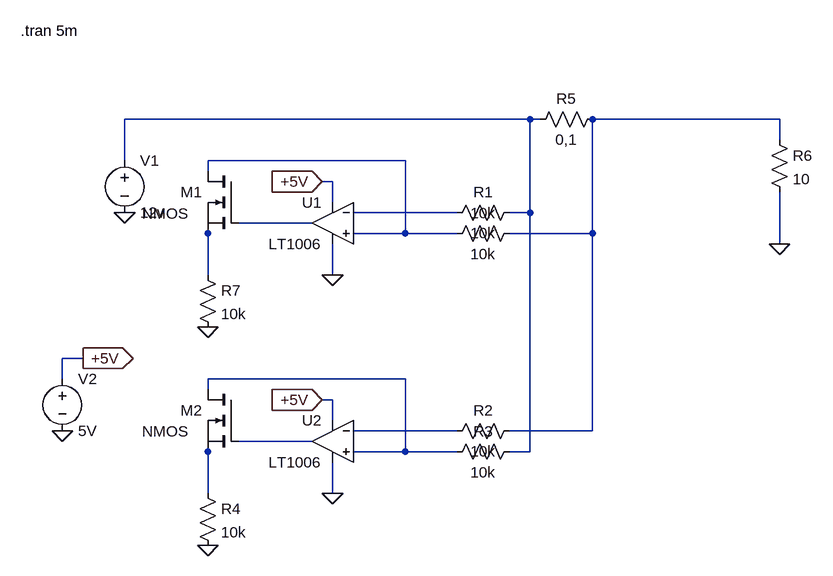
[diagram p0: schematic Meusure courrant bidir 1.asc]
Meusure courrant bidir 1.asc, the LTspice schematic file:
Version 4
SHEET 1 1092 884
WIRE 656 176 32 176
WIRE 672 176 656 176
WIRE 1040 176 752 176
WIRE 1040 208 1040 176
WIRE 32 240 32 176
WIRE 464 240 160 240
WIRE 160 256 160 240
WIRE 352 272 336 272
WIRE 352 304 352 272
WIRE 544 320 384 320
WIRE 656 320 656 176
WIRE 656 320 624 320
WIRE 320 336 208 336
WIRE 160 352 160 336
WIRE 464 352 464 240
WIRE 464 352 384 352
WIRE 544 352 464 352
WIRE 752 352 752 176
WIRE 752 352 624 352
WIRE 1040 368 1040 288
WIRE 160 416 160 352
WIRE 352 416 352 368
WIRE -32 544 -64 544
WIRE -64 576 -64 544
WIRE 464 576 160 576
WIRE 160 592 160 576
WIRE 352 608 336 608
WIRE 352 640 352 608
WIRE 544 656 384 656
WIRE 752 656 752 352
WIRE 752 656 624 656
WIRE 320 672 208 672
WIRE 160 688 160 672
WIRE 464 688 464 576
WIRE 464 688 384 688
WIRE 544 688 464 688
WIRE 656 688 656 320
WIRE 656 688 624 688
WIRE 160 752 160 688
WIRE 352 752 352 704
FLAG 32 320 0
FLAG 1040 368 0
FLAG -32 544 +5V
IOPIN -32 544 Out
FLAG -64 656 0
FLAG 160 496 0
FLAG 336 272 +5V
IOPIN 336 272 In
FLAG 352 416 0
FLAG 160 832 0
FLAG 336 608 +5V
IOPIN 336 608 In
FLAG 352 752 0
SYMBOL OpAmps/LT1006 352 272 M0
SYMATTR InstName U1
SYMBOL res 640 304 R90
WINDOW 0 0 56 VBottom 2
WINDOW 3 32 56 VTop 2
SYMATTR InstName R1
SYMATTR Value 10k
SYMBOL res 640 336 R90
WINDOW 0 0 56 VBottom 2
WINDOW 3 32 56 VTop 2
SYMATTR InstName 10k
SYMATTR Value 10k
SYMBOL res 768 160 R90
WINDOW 0 0 56 VBottom 2
WINDOW 3 32 56 VTop 2
SYMATTR InstName R5
SYMATTR Value 0,1
SYMBOL voltage 32 224 R0
SYMATTR InstName V1
SYMATTR Value 12v
SYMBOL res 1024 192 R0
SYMATTR InstName R6
SYMATTR Value 10
SYMBOL voltage -64 560 R0
SYMATTR InstName V2
SYMATTR Value 5V
SYMBOL nmos 208 256 M0
WINDOW 3 77 65 Left 2
SYMATTR InstName M1
SYMBOL res 144 400 R0
SYMATTR InstName R7
SYMATTR Value 10k
SYMBOL OpAmps/LT1006 352 608 M0
SYMATTR InstName U2
SYMBOL res 640 640 R90
WINDOW 0 0 56 VBottom 2
WINDOW 3 32 56 VTop 2
SYMATTR InstName R2
SYMATTR Value 10k
SYMBOL res 640 672 R90
WINDOW 0 0 56 VBottom 2
WINDOW 3 32 56 VTop 2
SYMATTR InstName R3
SYMATTR Value 10k
SYMBOL nmos 208 592 M0
WINDOW 3 77 65 Left 2
SYMATTR InstName M2
SYMBOL res 144 736 R0
SYMATTR InstName R4
SYMATTR Value 10k
TEXT -128 40 Left 2 !.tran 5m

The netlist it stands for:
* Meusure courrant bidir 1.asc
XU1 N003 N004 +5V 0 N005 LT1006  ; pins In+ In- V+ V- OUT
R1 N001 N004 10k
R§10k N002 N003 10k
R5 N002 N001 0,1
V1 N001 0 12v
R6 N002 0 10
V2 +5V 0 5V
M1 N003 N005 N006 N006 NMOS
R7 N006 0 10k
XU2 N007 N008 +5V 0 N009 LT1006  ; pins In+ In- V+ V- OUT
R2 N002 N008 10k
R3 N001 N007 10k
M2 N007 N009 N010 N010 NMOS
R4 N010 0 10k
.model NMOS NMOS
.model PMOS PMOS
.lib standard.mos
.tran 5m
.lib LTC.lib
.backanno
.end